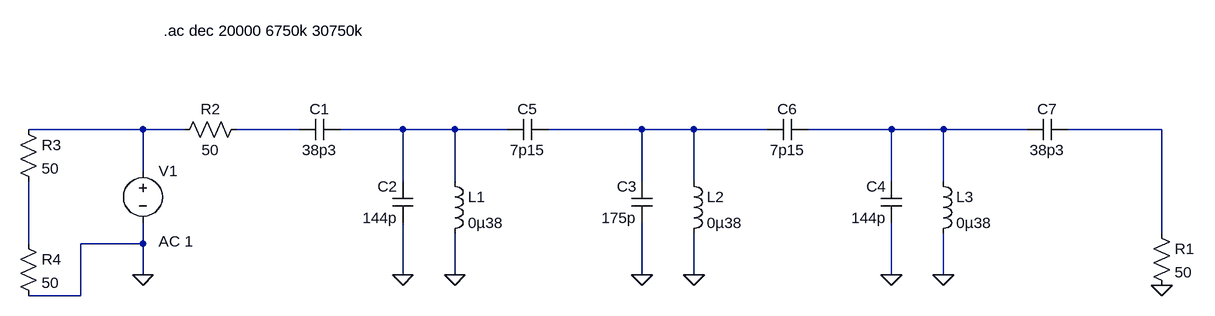
[diagram p0: schematic Draft1.asc]
Draft1.asc, the LTspice schematic file:
Version 4
SHEET 1 880 680
WIRE -1168 0 -1344 0
WIRE -1104 0 -1168 0
WIRE -928 0 -1024 0
WIRE -768 0 -864 0
WIRE -688 0 -768 0
WIRE -608 0 -688 0
WIRE -400 0 -544 0
WIRE -320 0 -400 0
WIRE -208 0 -320 0
WIRE -16 0 -144 0
WIRE 64 0 -16 0
WIRE 192 0 64 0
WIRE 400 0 256 0
WIRE -1168 64 -1168 0
WIRE -768 80 -768 0
WIRE -688 80 -688 0
WIRE -400 80 -400 0
WIRE -320 80 -320 0
WIRE -16 80 -16 0
WIRE 64 80 64 0
WIRE 400 160 400 0
WIRE -1344 176 -1344 80
WIRE -1168 176 -1168 144
WIRE -1168 176 -1264 176
WIRE -1168 224 -1168 176
WIRE -768 224 -768 144
WIRE -688 224 -688 160
WIRE -400 224 -400 144
WIRE -320 224 -320 160
WIRE -16 224 -16 144
WIRE 64 224 64 160
WIRE -1264 256 -1264 176
WIRE -1264 256 -1344 256
FLAG 400 240 0
FLAG -1168 224 0
FLAG -768 224 0
FLAG -688 224 0
FLAG -400 224 0
FLAG -320 224 0
FLAG -16 224 0
FLAG 64 224 0
SYMBOL res 384 144 R0
SYMATTR InstName R1
SYMATTR Value 50
SYMBOL res -1008 -16 R90
WINDOW 0 0 56 VBottom 2
WINDOW 3 32 56 VTop 2
SYMATTR InstName R2
SYMATTR Value 50
SYMBOL voltage -1168 48 R0
WINDOW 123 24 124 Left 2
WINDOW 39 0 0 Left 2
SYMATTR Value2 AC 1
SYMATTR InstName V1
SYMATTR Value ""
SYMBOL cap -864 -16 R90
WINDOW 0 0 32 VBottom 2
WINDOW 3 32 32 VTop 2
SYMATTR InstName C1
SYMATTR Value 38p3
SYMBOL cap -752 144 R180
WINDOW 0 24 56 Left 2
WINDOW 3 24 8 Left 2
SYMATTR InstName C2
SYMATTR Value 144p
SYMBOL cap -384 144 R180
WINDOW 0 24 56 Left 2
WINDOW 3 24 8 Left 2
SYMATTR InstName C3
SYMATTR Value 175p
SYMBOL cap 0 144 R180
WINDOW 0 24 56 Left 2
WINDOW 3 24 8 Left 2
SYMATTR InstName C4
SYMATTR Value 144p
SYMBOL cap -608 16 R270
WINDOW 0 32 32 VTop 2
WINDOW 3 0 32 VBottom 2
SYMATTR InstName C5
SYMATTR Value 7p15
SYMBOL cap -208 16 R270
WINDOW 0 32 32 VTop 2
WINDOW 3 0 32 VBottom 2
SYMATTR InstName C6
SYMATTR Value 7p15
SYMBOL cap 192 16 R270
WINDOW 0 32 32 VTop 2
WINDOW 3 0 32 VBottom 2
SYMATTR InstName C7
SYMATTR Value 38p3
SYMBOL ind -704 64 R0
SYMATTR InstName L1
SYMATTR Value 0µ38
SYMBOL ind -336 64 R0
SYMATTR InstName L2
SYMATTR Value 0µ38
SYMBOL ind 48 64 R0
SYMATTR InstName L3
SYMATTR Value 0µ38
SYMBOL res -1360 -16 R0
SYMATTR InstName R3
SYMATTR Value 50
SYMBOL res -1360 160 R0
SYMATTR InstName R4
SYMATTR Value 50
TEXT -1136 -152 Left 2 !.ac dec 20000 6750k 30750k

The netlist it stands for:
* Draft1.asc
R1 N006 0 50
R2 N002 N001 50
V1 N001 0 AC 1
C1 N003 N002 38p3
C2 0 N003 144p
C3 0 N004 175p
C4 0 N005 144p
C5 N003 N004 7p15
C6 N004 N005 7p15
C7 N005 N006 38p3
L1 N003 0 0µ38
L2 N004 0 0µ38
L3 N005 0 0µ38
R3 N001 N007 50
R4 N007 0 50
.ac dec 20000 6750k 30750k
.backanno
.end